# Altium schematic sheet Encoder_Sheet.SchDoc
size A
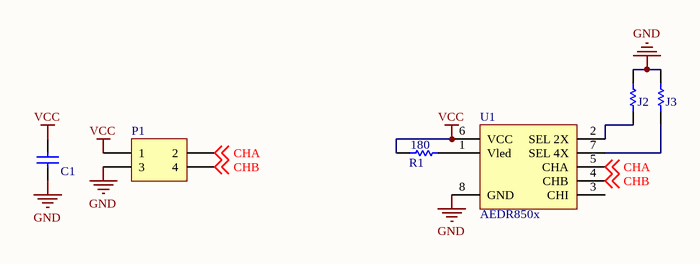
[diagram p0: Encoder_Sheet.SchDoc]

## Parts
C1  ?F  [1608[0603]]  (value not drawn)
J2  *  [1005[0402]]  (value not drawn)
J3  *  [1005[0402]]  (value not drawn)
P1  Header 2X2  [HDR2X2]  (value not drawn)
R1  180  [1608[0603]]
U1  AEDR850x  [AEDR-850x]

## Nets
GND: C1.1 J2.2 J3.2 P1.3 U1.8(GND)
VCC: C1.2 P1.1 R1.1 U1.6(VCC)
CHA: P1.2 U1.5(CHA) ; off-sheet CHA
CHB: P1.4 U1.4(CHB) ; off-sheet CHB
NetJ2_1: J2.1 U1.2(SEL_2X)
NetJ3_1: J3.1 U1.7(SEL_4X)
NetR1_2: R1.2 U1.1(Vled)

Not connected (* = marked no-connect by the designer): U1 3(CHI)

## Library data of the parts
C1 = Cap_BP: Capacitor; Value: ?F
J2 J3 R1 = Res
  J2 J3: Value: *
  R1: Value: 180
P1 = Header 2X2: Header, 2-Pin, Dual row; LatestRevisionDate: 17-Jul-2002; LatestRevisionNote: Re-released for DXP Platform.; Publisher: Altium Limited
U1 = AEDR850x: Reflectiveo Optical Encoder